# Altium schematic sheet bmsMaster_led.SchDoc
size A; SheetNumber: 7; SheetTotal: 7
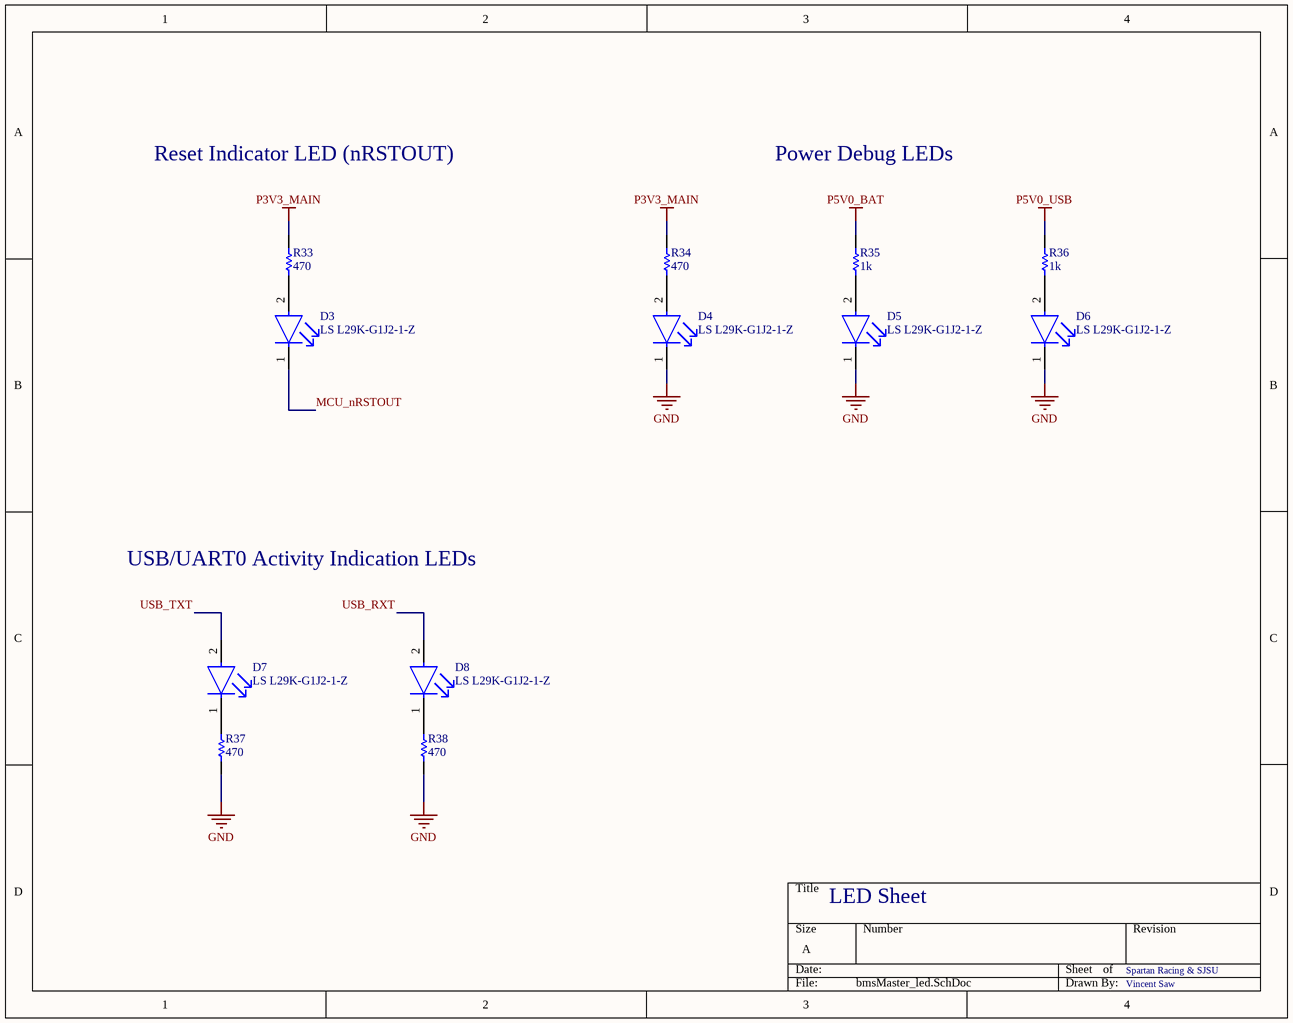
[diagram p0: bmsMaster_led.SchDoc]

## Parts
D3  LS L29K-G1J2-1-Z  [FP-LS_L29K-MFG]
D4  LS L29K-G1J2-1-Z  [FP-LS_L29K-MFG]
D5  LS L29K-G1J2-1-Z  [FP-LS_L29K-MFG]
D6  LS L29K-G1J2-1-Z  [FP-LS_L29K-MFG]
D7  LS L29K-G1J2-1-Z  [FP-LS_L29K-MFG]
D8  LS L29K-G1J2-1-Z  [FP-LS_L29K-MFG]
R33  value 470  [RESC1608X50N]  (hidden comment: Resistor)
R34  value 470  [RESC1608X50N]  (hidden comment: Resistor)
R35  value 1k  [RESC1608X50N]  (hidden comment: Resistor)
R36  value 1k  [RESC1608X50N]  (hidden comment: Resistor)
R37  value 470  [RESC1608X50N]  (hidden comment: Resistor)
R38  value 470  [RESC1608X50N]  (hidden comment: Resistor)

## Nets
GND: D4.1(C) D5.1(C) D6.1(C) R37.1 R38.1
P3V3_MAIN: R33.2 R34.2
P5V0_BAT: R35.2
P5V0_USB: R36.2
MCU_nRSTOUT: D3.1(C)
USB_RXT: D8.2(A)
USB_TXT: D7.2(A)
NetD3_2: D3.2(A) R33.1
NetD4_2: D4.2(A) R34.1
NetD5_2: D5.2(A) R35.1
NetD6_2: D6.2(A) R36.1
NetD7_1: D7.1(C) R37.2
NetD8_1: D8.1(C) R38.2

## Notes on the sheet
- Reset Indicator LED (nRSTOUT)
- Power Debug LEDs
- USB/UART0 Activity Indication LEDs
- LED Sheet
- Spartan Racing & SJSU
- Vincent Saw

## Library data of the parts
D3-D8 = CMP-62016-000014-1: LED RED DIFFUSED 0603 SMD; Manufacturer: Osram Opto; Luminous Flux: 0.0081/0.0254lm; Forward Voltage: 1.8V; Luminous Intensity: 1.8-2.24/5.6-7.1mcd; Reverse Voltage: 12V; Peak Emmision Wavelength: 643nm; Max Junction Temp: +110°C; Viewing Angle: 160°; Wavelength: 630nm; Forward Current: 2mA; Led Orientation: Top View; Category: Diode; Temperature Range High: +100°C; Automotive: No; Temperature: -40°C to +100°C; Device Class L3: unset; Mouser Description: LED Uni-Color Red 643nm Automotive 2-Pin SMD T/R; Manufacturer Part Number: LS L29K-G1J2-1-Z; ComponentLink2Description: Datasheet; Lead Free: Yes; Device Class L2: LEDs; ComponentLink2URL: https://dammedia.osram.info/media/resource/hires/osram-dam-5662679/LS%20L29K_EN.pdf; Temperature Range Low: -40°C; RoHS: TRUE; Digikey Description: LED RED DIFFUSED 0603 SMD; Colour: Red; Device Class L1: Optoelectronics; Package: LS_L29K; Octopart: https://octopart.com/ls+l29k-g1j2-1-z-osram+opto-31093939; Height: 0.67mm
R33-R38 = Resistor: TC1: 0; SimulationGenericComponent: True; TC2: 0